# Altium project stepDown34063.PrjPcb
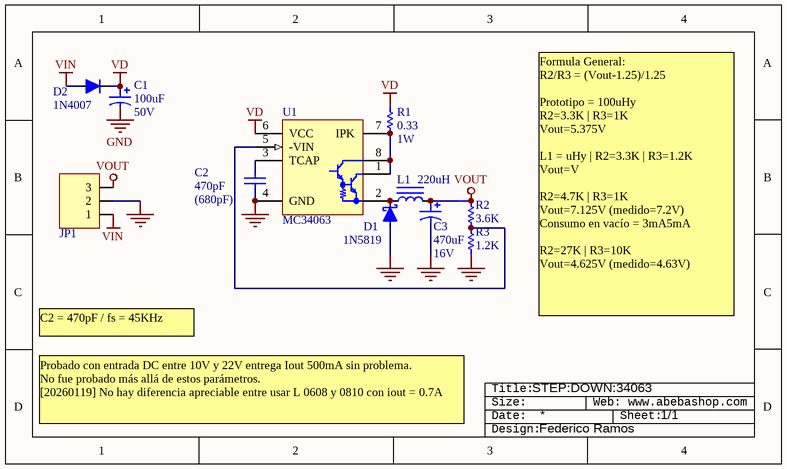
[diagram p0: stepDown34063.SchDoc]
1 sheet, 13 parts. Net scope: global (net labels, ports and power ports of the same name join across sheets).
Board file: stepDown34063.PcbDoc

## Sheet stepDown34063.SchDoc: MODULO STEP DOWN
size 146 x 86 mm; SheetNumber: 1; SheetTotal: 1; CurrentDateFGR: 20-03-2018; ModifiedDateFGR: 04-08-2018

### Parts
C1  value 100uF  Voltaje: 50V  [C_EL_6-3X11]  (hidden comment: Cap Pol)
C2  value 470pF  Technology: (680pF)  [c1206]  (hidden comment: Cap)
C3  value 470uF  Voltaje: 16V  [C_EL_6-3X11]  (hidden comment: Cap Pol)
D1  1N5819  [DIODE300_1MM]
D2  1N4007  [diode300_90B]
JP1  Header3x1  [HDR3x1_90_REVES]  (value not drawn)
L1  value 220uH  [L_10X12]  (hidden comment: Inductor)
R1  Resistencia: 0.33  [RES300TH]  (hidden comment: Resistencia 1W; 100Kohm)
R2  Resistencia: 3.6K  [R1206]  (hidden comment: Resistencia 1206; 1Kohm)
R3  Resistencia: 1.2K  [R1206]  (hidden comment: Resistencia 1206; 1Kohm)
R4  Resistencia 1206; 0ohm  [R1206]  (value not drawn)
ROT?  Rotulo  (value not drawn)  (graphical)
U1  MC34063  [dip8z]

### Nets
GND: C1.2 C2.1 C3.2 D1.1(A) JP1.2 R3.1 U1.4(GND)
VD: C1.1 D2.2 R1.2 U1.6(VCC)
VIN: D2.1 JP1.1
VOUT: JP1.3 R2.1 R4.2
NetC2_2: C2.2 U1.3(TCAP)
NetC3_1: C3.1 L1.2 R4.1
NetD1_2: D1.2(K) L1.1 U1.2(SWE)
NetR1_1: R1.1 U1.1(SWC) U1.7(IPK) U1.8(DRVC)
NetR2_2: R2.2 R3.2 U1.5(-VIN)

### Notes on the sheet
- C2 = 470pF / fs = 45KHz
- Formula General:
  R2/R3 = (Vout-1.25)/1.25
  Prototipo = 100uHy
  R2=3.3K | R3=1K
  Vout=5.375V
  L1 = uHy | R2=3.3K | R3=1.2K
  Vout=V
  R2=4.7K | R3=1K
  Vout=7.125V (medido=7.2V)
  Consumo en vacío = 3mA5mA
  R2=27K | R3=10K
  Vout=4.625V (medido=4.63V)
- Probado con entrada DC entre 10V y 22V entrega Iout 500mA sin problema.
  No fue probado más allá de estos parámetros.
  [20260119] No hay diferencia apreciable entre usar L 0608 y 0810 con iout = 0.7A
- STEP:DOWN:34063
- 1/1
- Federico Ramos
- (in symbol Resistencia 1W; 100Kohm) 1W
- (in symbol Rotulo) Title:; Size:; Web: www.abebashop.com; Date:; Sheet:; Design:

### Library data of the parts
C1 C3 = Cap Pol: Capacitor Polarizado; Price: ?
C2 = Cap: Capacitor; Voltage: 50V; Price: 0.25
D1 = 1N5819: Schottky Diode 1A 40V; Revision: July-2002: Re-released for DXP Platform.
D2 = 1N4007: Codigo Elemon: DI1152060; Dolares Elemon: 0.01989
JP1 = Header3x1: Header 3x1; Price: ?
R1 = Resistencia 1W; 100Kohm: Codigo Elemon: RS4036305; Dolares Elemon: 0.06231
R2 R3 = Resistencia 1206; 1Kohm: Codigo Elemon: RS3886185; Dolares Elemon: 0.00720
R4 = Resistencia 1206; 0ohm: Codigo Elemon: RS3885900; Dolares Elemon: 0.00720
ROT? = Rotulo: Rotulo [consolas]
U1 = MC34063: DC-to-DC Converter Control Circuit
L1 = Inductor: Revision: July-2002: Re-released for DXP Platform.